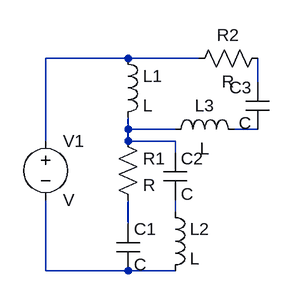
[diagram p0: schematic Test.asc]
Test.asc, the LTspice schematic file:
Version 4
SHEET 1 880 680
WIRE 64 0 -48 0
WIRE 160 0 64 0
WIRE 240 32 240 0
WIRE 64 96 64 80
WIRE 128 96 64 96
WIRE 240 96 208 96
WIRE -48 112 -48 0
WIRE 64 112 64 96
WIRE 128 112 64 112
WIRE 128 128 128 112
WIRE 128 208 128 192
WIRE 64 224 64 192
WIRE -48 288 -48 192
WIRE 64 288 -48 288
WIRE 128 288 64 288
SYMBOL voltage -48 96 R0
SYMATTR InstName V1
SYMBOL res 48 96 R0
SYMATTR InstName R1
SYMBOL ind 48 -16 R0
SYMATTR InstName L1
SYMBOL cap 48 224 R0
SYMATTR InstName C1
SYMBOL cap 112 128 R0
SYMATTR InstName C2
SYMBOL ind 112 192 R0
SYMATTR InstName L2
SYMBOL res 256 -16 R90
WINDOW 0 0 56 VBottom 2
WINDOW 3 32 56 VTop 2
SYMATTR InstName R2
SYMBOL cap 256 96 R180
WINDOW 0 24 56 Left 2
WINDOW 3 24 8 Left 2
SYMATTR InstName C3
SYMBOL ind 112 112 R270
WINDOW 0 32 56 VTop 2
WINDOW 3 5 56 VBottom 2
SYMATTR InstName L3

The netlist it stands for:
* Test.asc
V1 N001 N007 V
R1 N003 N006 R
L1 N001 N003 L
C1 N006 N007 C
C2 N003 N005 C
L2 N005 N007 L
R2 N002 N001 R
C3 N004 N002 C
L3 N003 N004 L
.backanno
.end